# Altium schematic sheet Schematic_2.SchDoc
size 381 x 241 mm; SheetNumber: 2; SheetTotal: 2
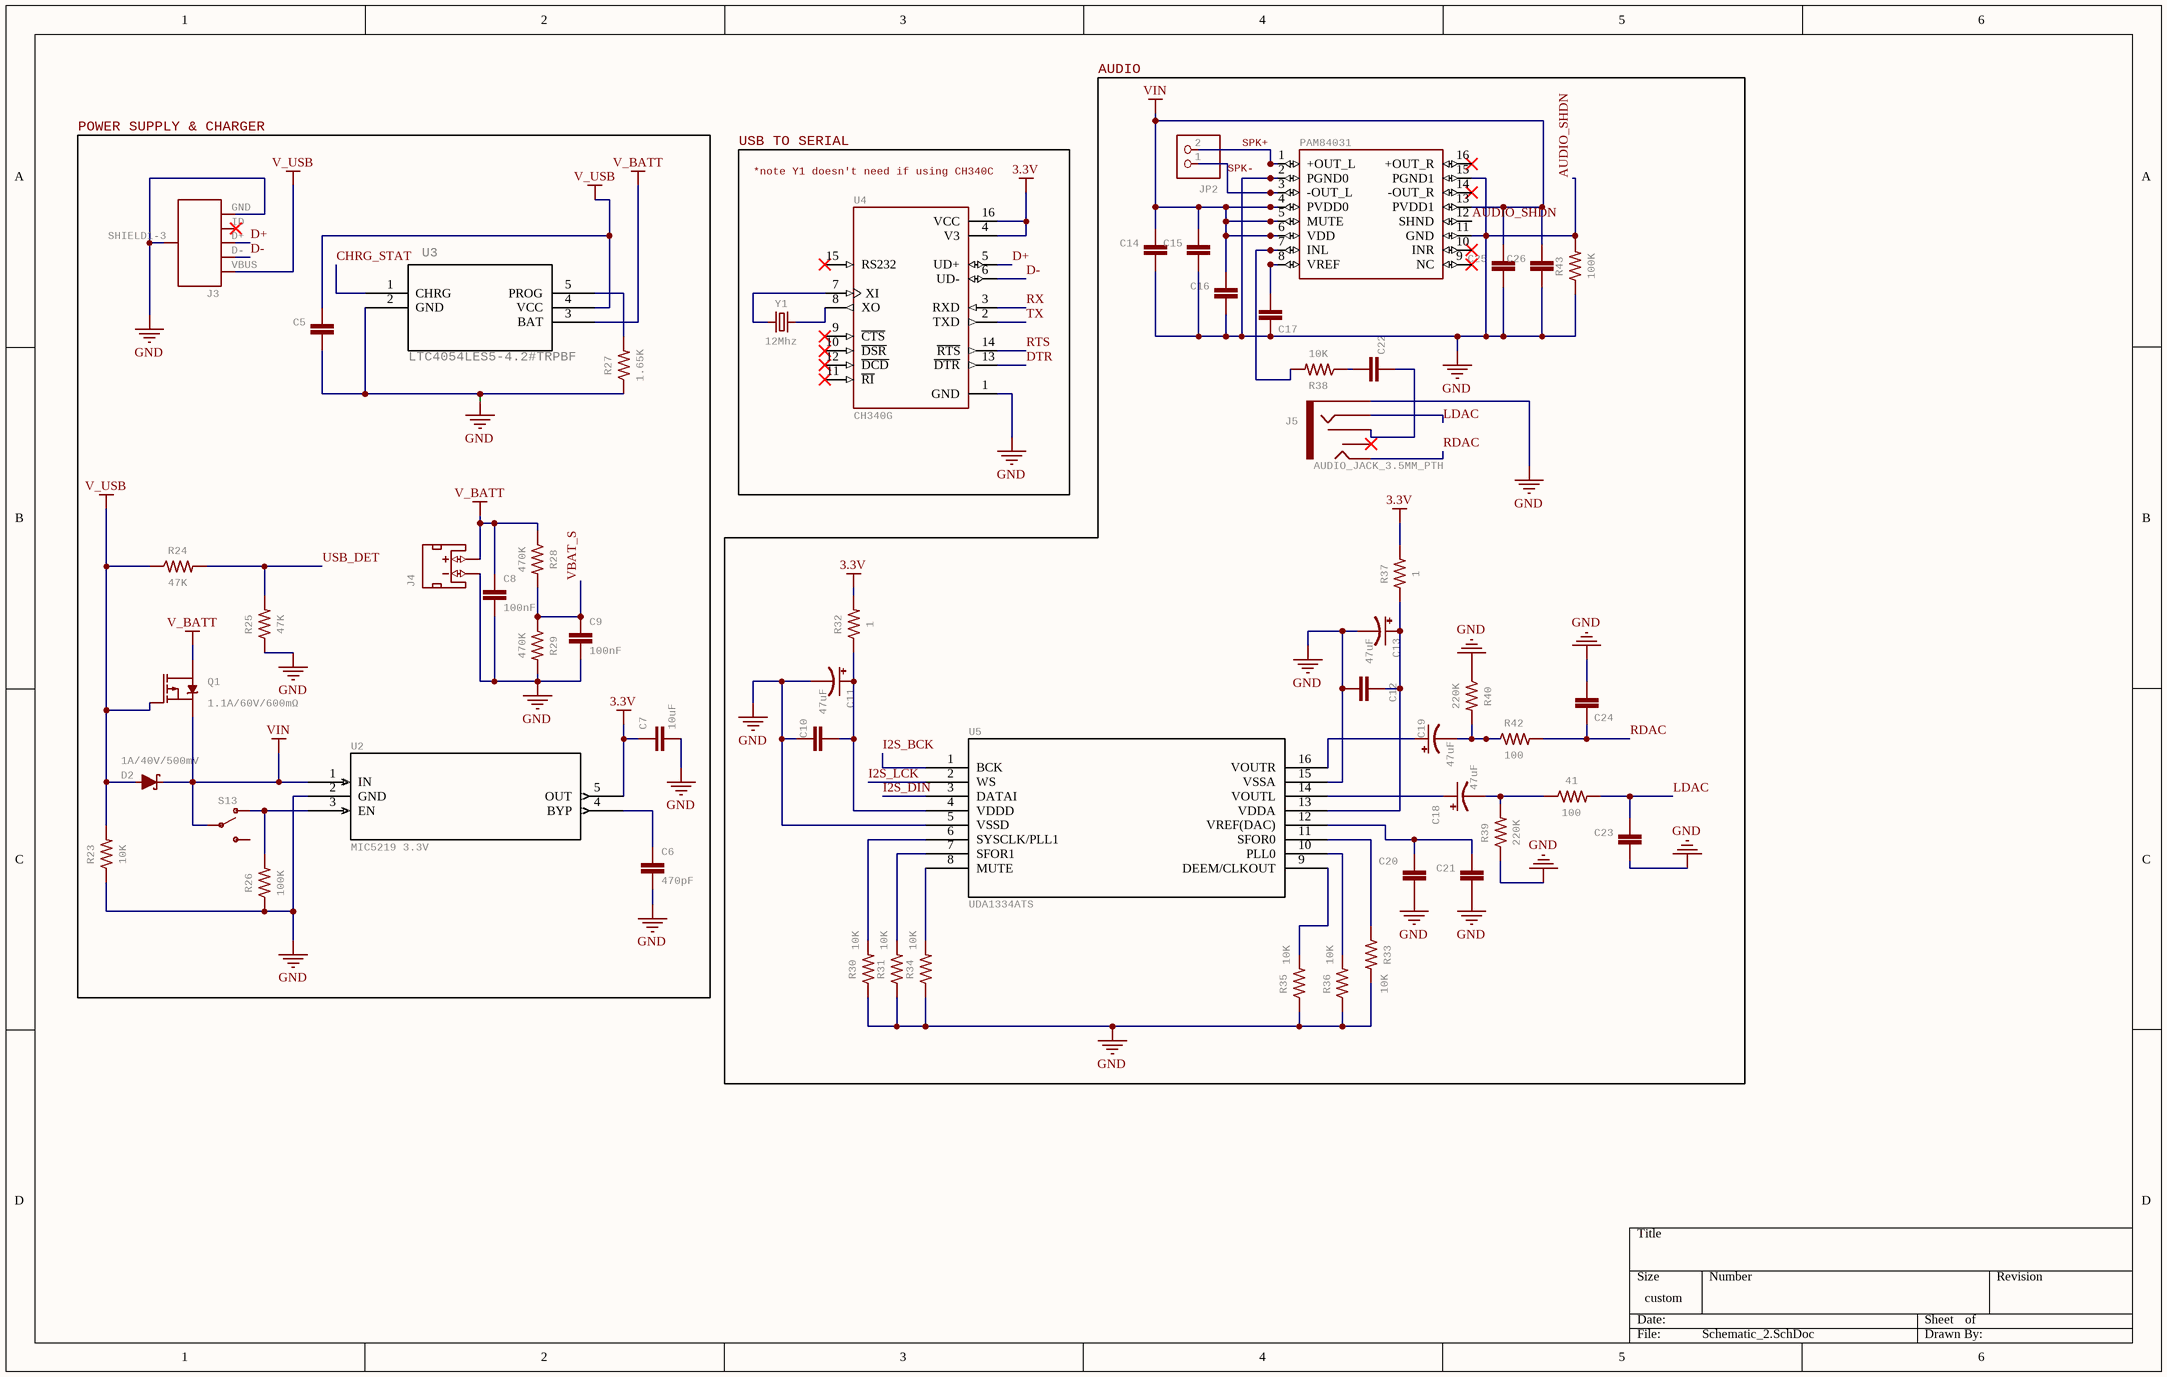
[diagram p0: Schematic_2.SchDoc]

## Parts
41  100  [0805 RESISTOR]
C5  (no value)  [0805]
C6  470pF  [0805]
C7  10uF  [0805]
C8  100nF  [0805]
C9  100nF  [0805]
C10  (no value)  [0805]
C11  47uF  [EIA3528]
C12  (no value)  [0805]
C13  47uF  [EIA3528]
C14  (no value)  [0805]
C15  (no value)  [0805]
C16  (no value)  [0805]
C17  (no value)  [0805]
C18  47uF  [EIA3528]
C19  47uF  [EIA3528]
C20  (no value)  [0805]
C21  (no value)  [0805]
C22  (no value)  [0805]
C23  (no value)  [0805]
C24  (no value)  [0805]
C25  (no value)  [0805]
C26  (no value)  [0805]
D2  1A/40V/500mV  [SMA-DIODE]
J3  (no value)  [USB-B-MICRO-SMD]
J4  (no value)  [JST-2-SMD]
J5  AUDIO_JACK_3.5MM_PTH  [AUDIO-JACK]
JP2  (no value)  [1X02M]
PAM84031  PAM8403  [SOP-16]  (value not drawn)
Q1  1.1A/60V/600mΩ  [SOT23-3]
R23  10K  [0805]
R24  47K  [0805]
R25  47K  [0805]
R26  100K  [0805]
R27  1.65K  [0805]
R28  470K  [0805]
R29  470K  [0805]
R30  10K  [0805]
R31  10K  [0805]
R32  1  [0805]
R33  10K  [0805]
R34  10K  [0805]
R35  10K  [0805]
R36  10K  [0805]
R37  1  [0805]
R38  10K  [0805]
R39  220K  [0805]
R40  220K  [0805]
R42  100  [0805]
R43  100K  [0805]
S13  (no value)  [SWITCH_SPST_SMD_A]
U2  MIC5219 3.3V  [SOT23-5]
U3  LTC4054LES5-4.2#TRPBF  [SOT95P280X100-5N]
U4  CH340G  [SO016]
U5  UDA1334ATS  [MICROBUILDER_SSOP16_4.4MM]
Y1  12Mhz  [CRYSTAL-SMD-5X3.2-4PAD]

## Blocks framed on the sheet
POWER SUPPLY & CHARGER: C5-C9 D2 J3 J4 Q1 R23-R29 S13 U2 U3
AUDIO: 41 C10-C26 J5 JP2 PAM84031 R30-R40 R42 R43 U5
USB TO SERIAL: U4 Y1

## Nets
3.3V: C7.1 R32.2 R37.2 U2.5(OUT) U4.4(V3) U4.16(VCC)
AUDIO_SHDN: C5.1 C6.2 C7.2 C8.2 C9.2 C10.1 C11.C(-) C12.1 C13.C(-) C14.1 C15.1 C16.1 C17.1 C20.1 C21.1 C23.1 C24.1 C25.1 C26.1 J3.GND J3.SHIELD1-3(SHIELD) J4.1(-) J5.SLEEVE PAM84031.2(PGND0) PAM84031.11(GND) PAM84031.12(SHND) PAM84031.15(PGND1) R23.1 R25.1 R26.1 R27.1 R29.2 R30.1 R31.1 R33.1 R34.1 R35.1 R36.1 R39.1 R40.1 R43.1 R43.2 U2.2(GND) U3.2(GND) U4.1(GND) U5.5(VSSD) U5.15(VSSA)  [also labelled GND]
V_BATT: C8.1 J4.2(+) Q1.3(D) R28.1 U3.3(BAT)
V_USB: C5.2 D2.A J3.VBUS Q1.1(G) R23.2 R24.1 U3.4(VCC)
VIN: C14.2 C15.2 C16.2 C25.2 C26.2 D2.C PAM84031.4(PVDD0) PAM84031.5(MUTE) PAM84031.6(VDD) PAM84031.13(PVDD1) Q1.2(S) S13.2(P) U2.1(IN)
CHRG_STAT: U3.1(CHRG)
D+: J3.D+ U4.5(UD+)
D-: J3.D- U4.6(UD-)
DTR: U4.13(~{DTR})
I2S_BCK: U5.1(BCK)
I2S_DIN: U5.3(DATAI)
I2S_LCK: U5.2(WS)
LDAC: 41.2 C23.2 J5.RING
RDAC: C24.2 J5.TIP R42.2
RTS: U4.14(~{RTS})
RX: U4.3(RXD)
SPK+: JP2.2 PAM84031.1(+OUT_L)
SPK-: JP2.1 PAM84031.3(-OUT_L)
TX: U4.2(TXD)
USB_DET: R24.2 R25.2
VBAT_S: C9.1 R28.2 R29.1
Net41_1: 41.1 C18.C(-) R39.2
NetC6_1: C6.1 U2.4(BYP)
NetC10_2: C10.2 C11.A(+) R32.1 U5.4(VDDD)
NetC12_2: C12.2 C13.A(+) R37.1 U5.13(VDDA)
NetC17_2: C17.2 PAM84031.8(VREF)
NetC18_A: C18.A(+) U5.14(VOUTL)
NetC19_A: C19.A(+) U5.16(VOUTR)
NetC19_C: C19.C(-) R40.2 R42.1
NetC20_2: C20.2 C21.2 U5.12(VREF(DAC))
NetC22_1: C22.1 R38.1
NetC22_2: C22.2 J5.RSH
NetPAM84031_7: PAM84031.7(INL) R38.2
NetR26_2: R26.2 S13.1(O) U2.3(EN)
NetR27_2: R27.2 U3.5(PROG)
NetR30_2: R30.2 U5.6(SYSCLK/PLL1)
NetR31_2: R31.2 U5.7(SFOR1)
NetR33_2: R33.2 U5.11(SFOR0)
NetR34_2: R34.2 U5.8(MUTE)
NetR35_2: R35.2 U5.9(DEEM/CLKOUT)
NetR36_2: R36.2 U5.10(PLL0)
NetU4_7: U4.7(XI) Y1.3
NetU4_8: U4.8(XO) Y1.1

Not connected (* = marked no-connect by the designer): J3 ID*; J4 NC1(PAD1) NC2(PAD2); J5 TSH*; PAM84031 9(NC)* 10(INR)* 14(-OUT_R)* 16(+OUT_R)*; S13 3(S); U4 9(~{CTS})* 10(~{DSR})* 11(~{RI})* 12(~{DCD})* 15(RS232)*

## Notes on the sheet
- (near U4) *note Y1 doesn't need if using CH340C

## Library data of the parts
41 R27 R30-R40 R42 R43 = 0.3OHM-0805-1/8W-1%: GateName_1: G$1; SymbolName_1: RESISTOR; DeviceSetName: 0.3OHM; PROD_ID: RES-11622; DeviceName: -0805-1/8W-1%; LibraryName: SparkFun-Resistors; Package: 0805
C5-C10 C12 C14-C17 C20-C26 = 2.2UF-0805-25V-(+80/-20%): GateName_1: G$1; SymbolName_1: CAP; DeviceSetName: 2.2UF; PROD_ID: CAP-10009; DeviceName: -0805-25V-(+80/-20%); LibraryName: SparkFun-Capacitors; Package: 0805
C11 C13 C18 C19 = 47UF-POLAR-EIA3528-10V-10%: GateName_1: G$1; SymbolName_1: CAP_POL; PROD_ID: CAP-08478; DeviceName: -EIA3528-10V-10%; LibraryName: SparkFun-Capacitors; DeviceSetName: 47UF-POLAR; Package: EIA3528
D2 = DIODE-SCHOTTKY-SS14: GateName_1: G$1; DeviceName: -SS14; PROD_ID: DIO-08053; SymbolName_1: DIODE-SCHOTTKY; LibraryName: SparkFun-DiscreteSemi; DeviceSetName: DIODE-SCHOTTKY; Package: SMA-DIODE
J3 = USB_MICRO-B_FEMALE-SMT_J3: GateName_1: G$1; SymbolName_1: USB-5PIN; PROD_ID: CONN-09505; SF_ID: PRT-08533; DeviceName: _FEMALE-SMT; LibraryName: SparkFun-Connectors; DeviceSetName: USB_MICRO-B; Package: USB-B-MICRO-SMD
J4 = JST_2MM_MALE_J4: JST_2MM_MALE; GateName_1: G$1; PROD_ID: CONN-11443; SF_ID: PRT-08612; SymbolName_1: JST_2MM_MALE; LibraryName: SparkFun-Connectors; DeviceSetName: JST_2MM_MALE; Package: JST-2-SMD
J5 = AUDIO_JACK_3.5MM_PTH_J5: GateName_1: G$1; SymbolName_1: AUDIO-JACK2; DeviceName: _PTH; PROD_ID: CONN-10353; SF_ID: PRT-08032; LibraryName: SparkFun-Connectors; DeviceSetName: AUDIO_JACK_3.5MM; Package: AUDIO-JACK
JP2 = PINHD-1X2_2.00_JP2: PINHD-1X2_2.00; GateName_1: G$1; SymbolName_1: PINHD2; DeviceName: _2.00; LibraryName: pinhead-1; DeviceSetName: PINHD-1X2; Package: 1X02M
PAM84031 = PAM8403_YES: Dual channel audio amplifier IC - PAM8403; GateName_1: G$1; SymbolName_1: PAM8403; LibraryName: PAM8403; DeviceSetName: PAM8403; Package: SOP-16
Q1 = MOSFET_PCH-SI2309DS: GateName_1: G$1; SymbolName_1: LABELED-PMOS; PROD_ID: TRANS-08285; DeviceName: -SI2309DS; LibraryName: SparkFun-DiscreteSemi; DeviceSetName: MOSFET_PCH; Package: SOT23-3
R23-R26 R28 R29 = 0.22OHM-0805-1/4W-1%: GateName_1: G$1; SymbolName_1: RESISTOR; PROD_ID: RES-09883; DeviceName: -0805-1/4W-1%; LibraryName: SparkFun-Resistors; DeviceSetName: 0.22OHM; Package: 0805
S13 = SWITCH-SPDT-SMD-RIGHT-ANGLE_1: GateName_1: 1; SymbolName_1: TOGGLE; PROD_ID: SWCH-10651; SF_ID: COM-00597; SF_SKU: COM-10860; DeviceName: -SMD-RIGHT-ANGLE; LibraryName: SparkFun-Switches; DeviceSetName: SWITCH-SPDT; Package: SWITCH_SPST_SMD_A
U2 = V_REG_MIC52195V: GateName_1: G$1; SymbolName_1: V-REG-LDO; DeviceName: 5V; PROD_ID: VREG-10107; LibraryName: SparkFun-IC-Power; DeviceSetName: V_REG_MIC5219; Package: SOT23-5
U3 = LTC4054LES5-4.2#TRPBF_U3: LTC4054LES5-4.2#TRPBF*?; GateName_1: A; MF: Linear Technology/Analog; SymbolName_1: LTC4054LES5-4.2#TRPBF; LibraryName: LTC4054LES5-4.2_TRPBF; DeviceSetName: LTC4054LES5-4.2#TRPBF*?; Package: SOT95P280X100-5N; DIGI-KEY_PART_NUMBER: LTC4054LES5-4.2#TRPBFCT-ND; DIGI-KEY_PURCHASE_URL: https://www.digikey.co.id/product-detail/en/linear-technology-analog-devices/LTC4054LES5-4.2-TRPBF/LTC4054LES5-4.2-TRPBFCT-ND/1888452?utm_source=snapeda&utm_medium=aggregator&utm_campaign=symbol; MP: LTC4054LES5-4.2#TRPBF; PACKAGE: SOT-23-5 Linear Technology
U4 = CH340GSMD_U4: CH340GSMD_SO016; GateName_1: U1; DeviceName: SMD; PROD_ID: IC-13498; SymbolName_1: CH340G; LibraryName: SparkFun-IC-Comms; DeviceSetName: CH340G; Package: SO016
U5 = UDA1334_U5: MICROBUILDER_AUDIO_I2S_UDA1334""; GateName_1: G$1; SymbolName_1: MICROBUILDER_UDA1334; DeviceName: ""; LibraryName: Adafruit UDA1334 I2S DAC; DeviceSetName: MICROBUILDER_AUDIO_I2S_UDA1334; Package: MICROBUILDER_SSOP16_4.4MM
Y1 = CRYSTALSMD_Y1: CRYSTALSMD-5X3.2-4PAD; GateName_1: G$1; SymbolName_1: CRYSTAL; DeviceName: SMD-5X3.2-4PAD; LibraryName: SparkFun-Clocks; DeviceSetName: CRYSTAL; Package: CRYSTAL-SMD-5X3.2-4PAD